# EAGLE design teensy (EAGLE 9.6.2)
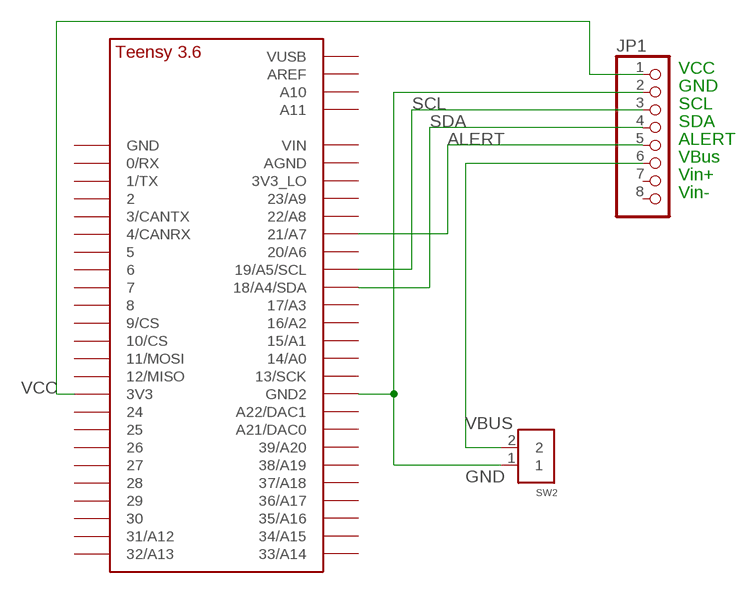
[diagram p0: schematic, sheet 1]

## Parts
JP1  PINHD-1X8  [1X08]
SW2  282834-2  [CONN_282834-2]
U1  TEENSY_3.5/3.6_BASIC  [TEENSY_3.5/3.6_BASIC]

## Nets
ALERT: JP1.5 U1.21/A7
GND: JP1.2 SW2.1 U1.GND2
SCL: JP1.3 U1.19/A5/SCL
SDA: JP1.4 U1.18/A4/SDA
VBUS: JP1.6 SW2.2
VCC: JP1.1 U1.3V3
Unconnected: JP1.7 JP1.8 U1.0/RX U1.1/TX U1.2 U1.3/CANTX U1.3V3_LO U1.4/CANRX U1.5 U1.6 U1.7 U1.8 U1.9/CS U1.10/CS U1.11/MOSI U1.12/MISO U1.13/SCK U1.14/A0 U1.15/A1 U1.16/A2 U1.17/A3 U1.20/A6 U1.21/DAC0(A21/DAC0) U1.22/A8 U1.23/A9 U1.24 U1.25 U1.26 U1.27 U1.28 U1.29 U1.30 U1.31/A12 U1.32/A13 U1.33/A14 U1.34/A15 U1.35/A16 U1.36/A17 U1.37/A18 U1.38/A19 U1.39/A20 U1.A10 U1.A11 U1.A22/DAC1 U1.AGND U1.AREF U1.GND U1.VIN U1.VUSB

## Notes on the sheet
- VCC
- GND
- SCL
- SDA
- ALERT
- VBus
- Vin+
- Vin-

## Library data of the parts
JP1 = pinhead:PINHD-1X8: PIN HEADER
SW2 = 282834-2:282834-2: Terminal block; 2.54mm; angled 90°; 0.03÷1mm2; ways: 2; 10A; H: 10mm Check prices <https://pricing.snapeda.com/parts/282834-2/TE%20Connectivity/view-part?ref=eda>; AVAILABILITY: Good; CENTERLINE_PITCH: 2.54 mm[.1 in]; COMMENT: 282834-2; DESCRIPTION: Wire-To-Board Terminal Block, 2, 150 V, 10 A, 30 Awg, 16 Awg, 1.4 Mm; EU_ROHS_COMPLIANCE: Compliant with Exemptions; MF: TE Connectivity; MP: 282834-2; NUMBER_OF_POSITIONS: 2; PACKAGE: None; PRICE: None; PURCHASE-URL: https://pricing.snapeda.com/search/part/282834-2/?ref=eda
U1 = Teensy356:TEENSY_3.5/3.6_BASIC

## Board
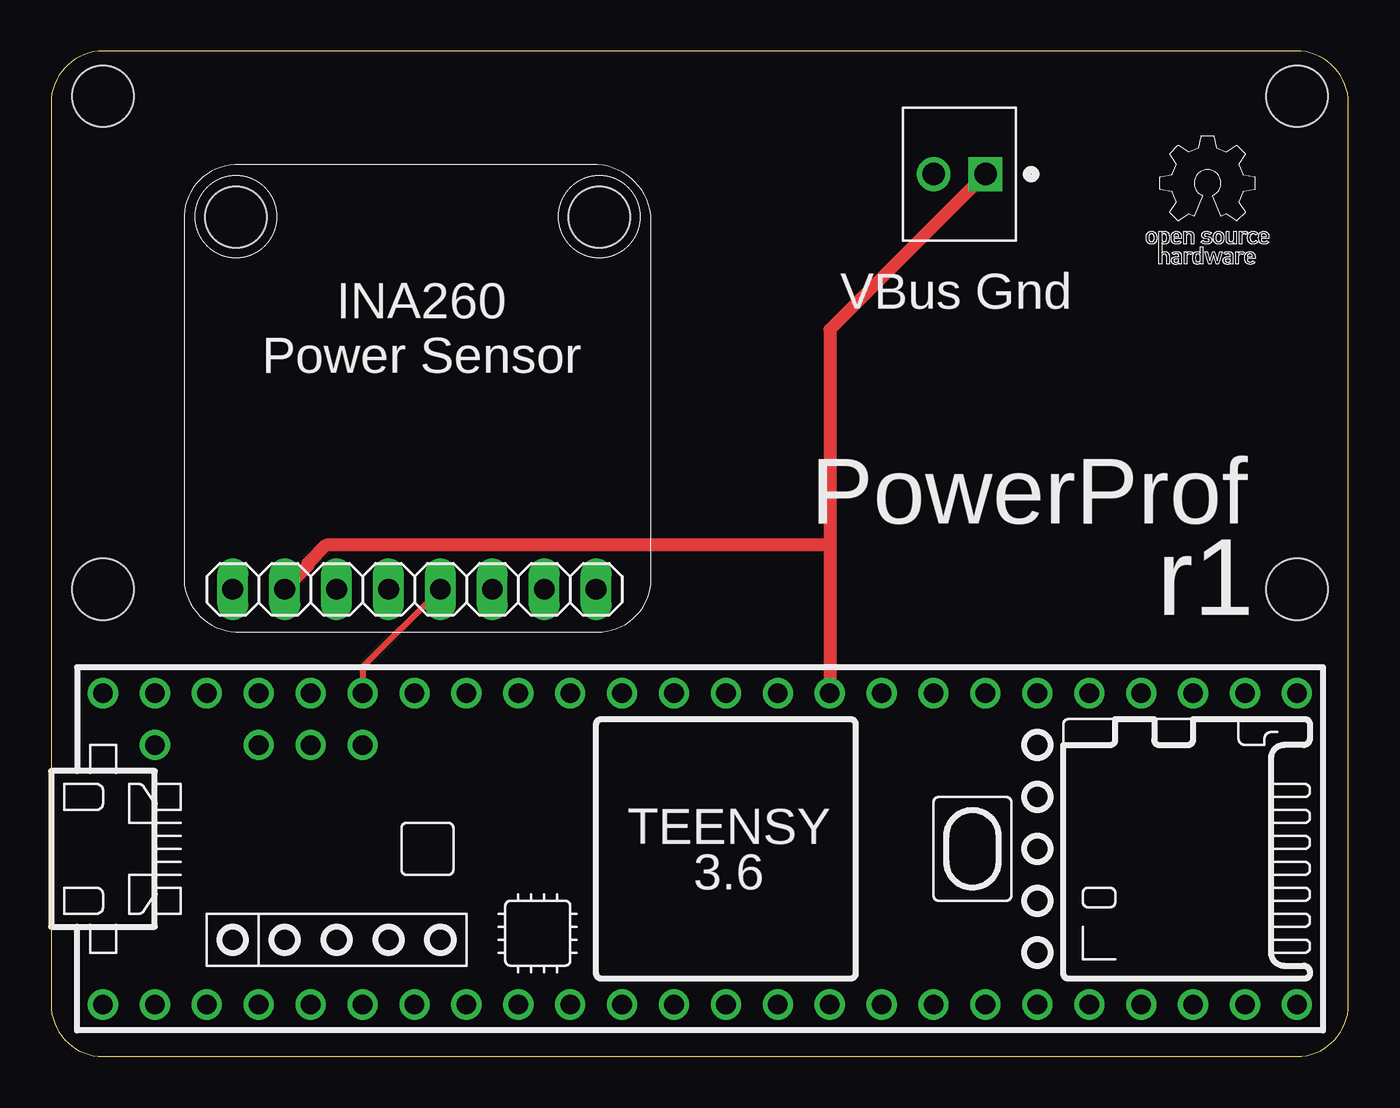
[diagram p1: board, top side]
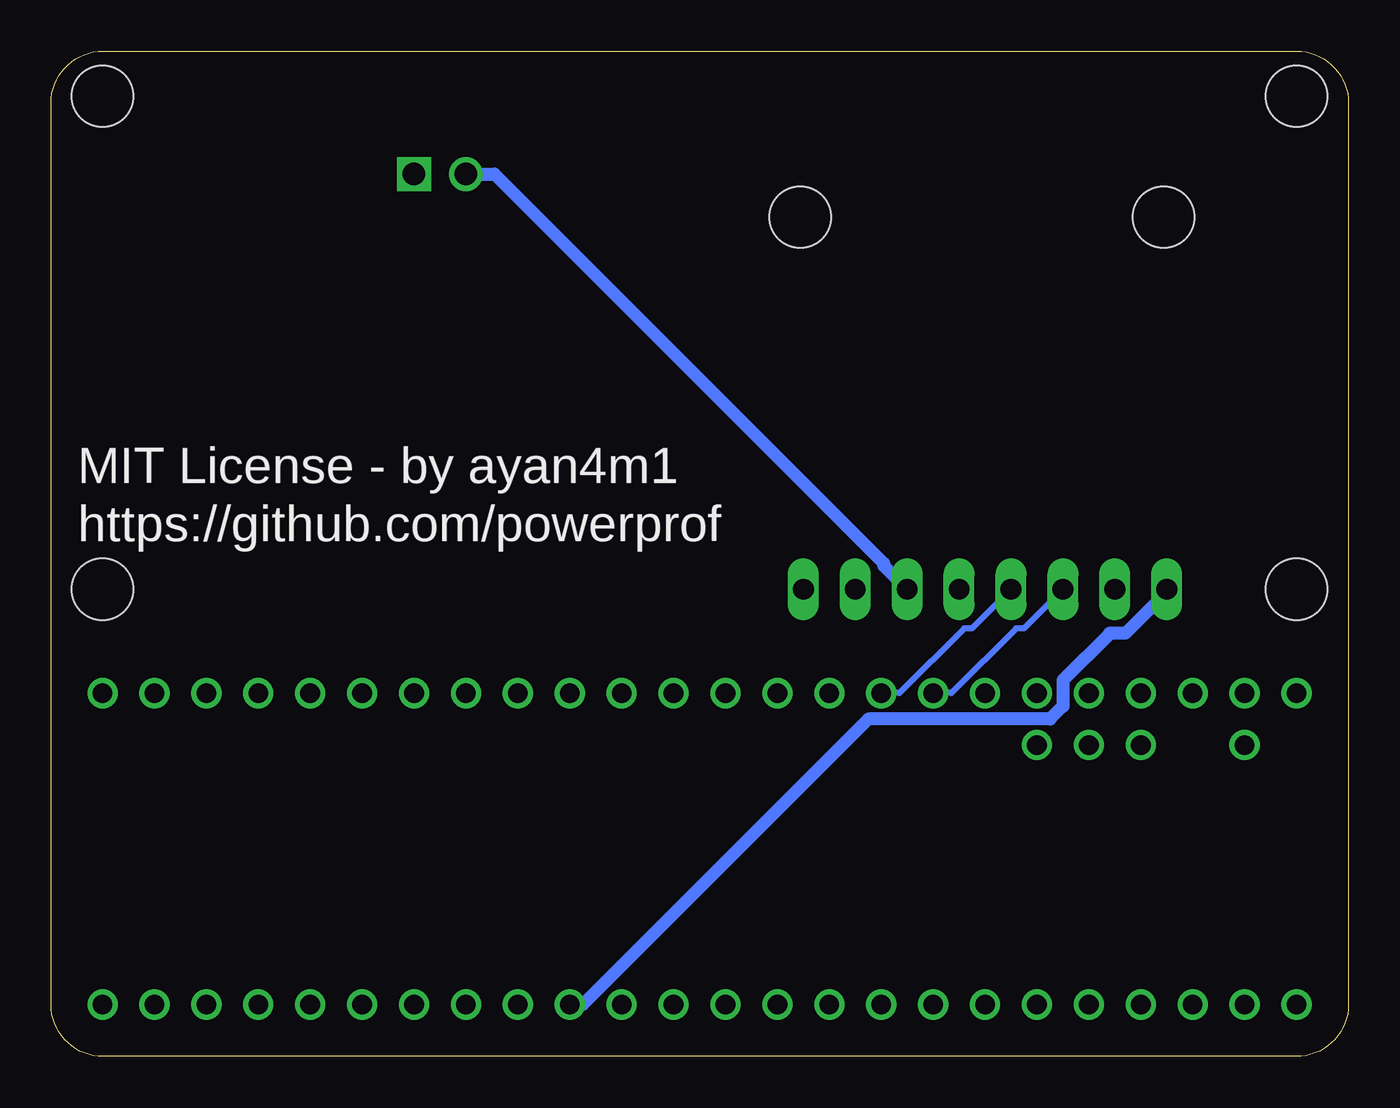
[diagram p2: board, bottom side, seen from below]

Size 63.48 x 49.2 mm. Coordinates in mm from the lower left corner, seen from the top.
Outline: 0,46.66 0,2.54 arc90 2.54,0 60.94,0 arc90 63.48,2.54 63.48,46.66 arc90 60.94,49.2 2.54,49.2 arc90 0,46.66
Copper layers (1*16): Top 0.035mm / dielectric 1.5mm / Bottom 0.035mm
Design rules "default *": minimum track width 12mil, minimum drill 0.35mm, track to track 8mil, track to pad 8mil, pad to pad 8mil, via to via 8mil, smd to smd 8mil, copper to edge 40mil, drill to drill 6mil, minimum pad ring 10mil, minimum via ring 8mil, stop-mask expansion 4mil, vias tented up to drill 0mil, thermal gap 10mil
Holes 3 mm at 2.54,46.99 60.96,46.99 60.96,22.86 2.54,22.86 9.04,41.07 26.82,41.07

### Footprints (pad centres in the part's own frame; a part is rotated, then mirrored left to right if it is on the bottom)
1X08 = drill 1.016 long: 1 -8.89,0; 2 -6.35,0; 3 -3.81,0; 4 -1.27,0; 5 1.27,0; 6 3.81,0; 7 6.35,0; 8 8.89,0
CONN_282834-2 = drill 1.1 square: 1 -1.27,0 | drill 1.1: 2 1.27,0
TEENSY_3.5/3.6_BASIC = drill 0.965: 0/RX -25.4,-7.62; 1/TX -22.86,-7.62; 2 -20.32,-7.62; 3/CANTX -17.78,-7.62; 3V3 7.62,-7.62; 3V3_LO -22.86,7.62; 4/CANRX -15.24,-7.62; 5 -12.7,-7.62; 6 -10.16,-7.62; 7 -7.62,-7.62; 8 -5.08,-7.62; 9/CS -2.54,-7.62; 10/CS 0,-7.62; 11/MOSI 2.54,-7.62; 12/MISO 5.08,-7.62; 13/SCK 5.08,7.62; 14/A0 2.54,7.62; 15/A1 0,7.62; 16/A2 -2.54,7.62; 17/A3 -5.08,7.62; 18/A4/SDA -7.62,7.62; 19/A5/SCL -10.16,7.62; 20/A6 -12.7,7.62; 21/A7 -15.24,7.62; 21/DAC0 12.7,7.62; 22/A8 -17.78,7.62; 23/A9 -20.32,7.62; 24 10.16,-7.62; 25 12.7,-7.62; 26 15.24,-7.62; 27 17.78,-7.62; 28 20.32,-7.62; 29 22.86,-7.62; 30 25.4,-7.62; 31/A12 27.94,-7.62; 32/A13 30.48,-7.62; 33/A14 30.48,7.62; 34/A15 27.94,7.62; 35/A16 25.4,7.62; 36/A17 22.86,7.62; 37/A18 20.32,7.62; 38/A19 17.78,7.62; 39/A20 15.24,7.62; A10 -17.78,5.08; A11 -15.24,5.08; A22/DAC1 10.16,7.62; AGND -25.4,7.62; AREF -20.32,5.08; GND -27.94,-7.62; GND2 7.62,7.62; VIN -27.94,7.62; VUSB -25.4,5.08

### Placement (x,y rotation side)
JP1  17.78,22.86 0 top
SW2  44.45,43.18 180 top
U1  30.48,10.16 0 top

### Tracks (layer width: path | path; a pad name or v marks a point on that pad's centre or on a via)
ALERT
  Top 0.305: U1.21/A7 15.24,19.05 JP1.5
GND
  Top 0.635: 38.1,25.02 38.1,35.56 SW2.1 | 38.1,25.02 U1.GND2 | JP1.2 12.57,24 12.57,24.13 13.46,25.02 38.1,25.02
SCL
  Bottom 0.305: U1.19/A5/SCL 19.43,17.78 16.26,20.95 15.88,20.95 JP1.3
SDA
  Bottom 0.305: U1.18/A4/SDA 21.97,17.78 18.8,20.95 18.41,20.95 JP1.4
VBUS
  Bottom 0.635: JP1.6 22.73,24 22.73,24.13 41.78,43.18 SW2.2
VCC
  Bottom 0.635: U1.3V3 37.47,2.54 23.5,16.51 14.61,16.51 13.97,17.14 13.97,18.42 11.68,20.7 10.92,20.7 8.89,22.73 JP1.1

### Text on the board
tPlace: VBus | Gnd | INA260 / Power Sensor | r1
tNames: PowerProf
bNames: MIT License - by ayan4m1 | https://github.com/powerprof